# EAGLE design SUSTAINA-Constant-Voltage-Board (EAGLE 9.6.2)
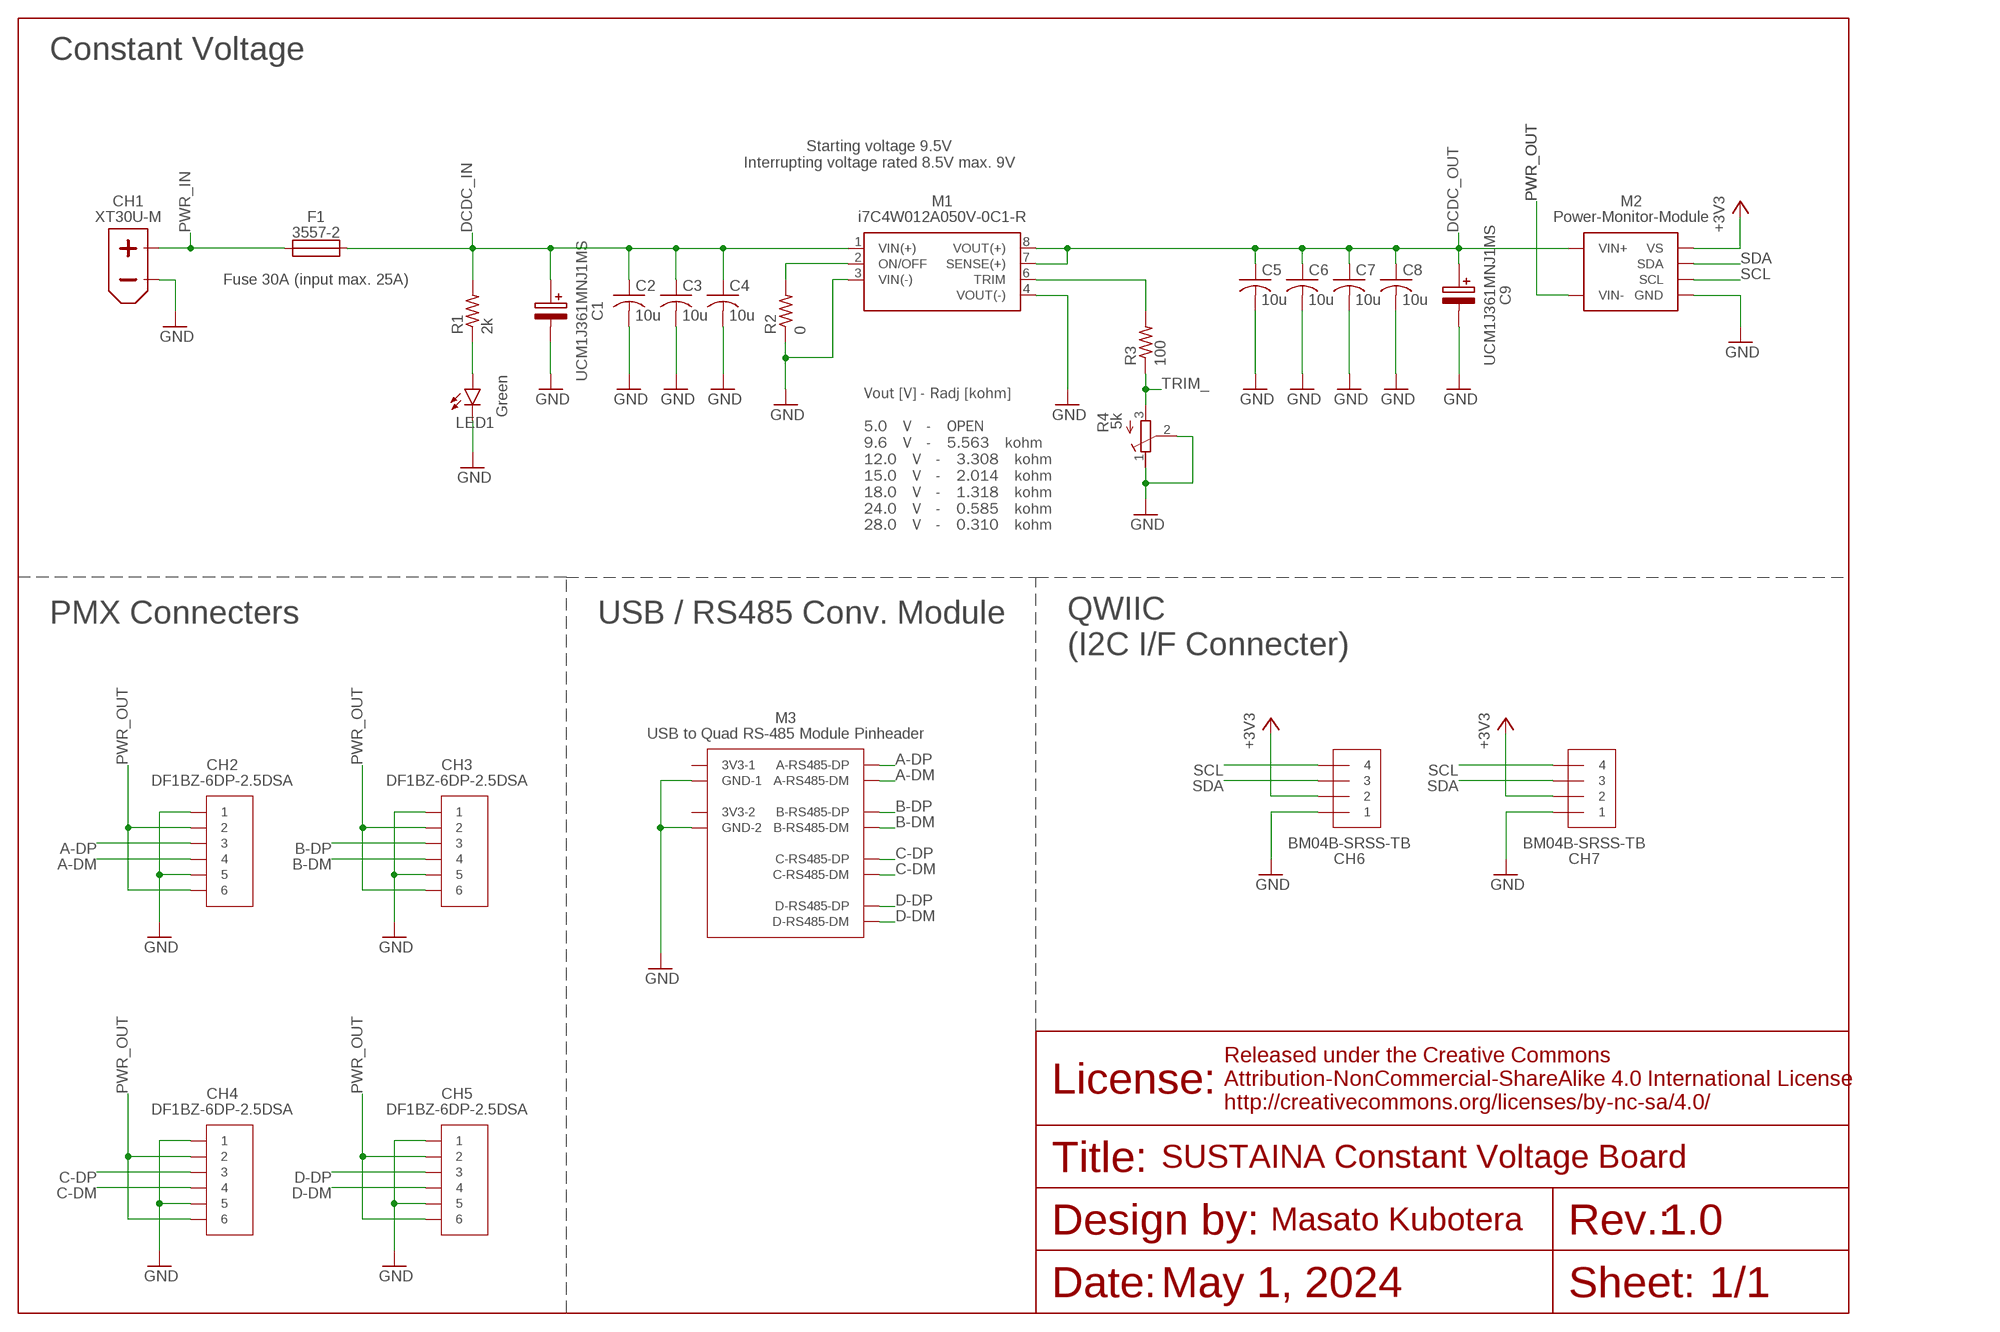
[diagram p0: schematic, sheet 1]

## Parts
C1  UCM1J361MNJ1MS  [UCM1J361MNJ1MS]
C2  10u  C-USC1210  [C1210]
C3  10u  C-USC1210  [C1210]
C4  10u  C-USC1210  [C1210]
C5  10u  C-USC1210  [C1210]
C6  10u  C-USC1210  [C1210]
C7  10u  C-USC1210  [C1210]
C8  10u  C-USC1210  [C1210]
C9  UCM1J361MNJ1MS  [UCM1J361MNJ1MS]
CH1  XT30U-M  [XT30U-M]
CH2  DF1BZ-6DP-25DSA  [DF1BZ-6DP-25DSA]
CH3  DF1BZ-6DP-25DSA  [DF1BZ-6DP-25DSA]
CH4  DF1BZ-6DP-25DSA  [DF1BZ-6DP-25DSA]
CH5  DF1BZ-6DP-25DSA  [DF1BZ-6DP-25DSA]
CH6  BM04B-SRSS-TB  [BM04B-SRSS-TB]
CH7  BM04B-SRSS-TB  [BM04B-SRSS-TB]
F1  3557-2  [3557-2]
LED1  Green  LEDSML0603  [SML0603]
M1  I7C4W012A050V-0C1-R  [I7C4W012A050V-001-R]
M2  POWER-MONITOR-MODULE  [POWER-MONITOR-MODULE]
M3  USB-TO-QUAD-RS-485-CONV-MODULETPLACE  [USB-TO-QUAD-RS-485-CONV-MODULE-TPLACE]
R1  2k  R-US_R0603  [R0603]
R2  0  R-US_R0603  [R0603]
R3  100  R-US_R0603  [R0603]
R4  5k  R-TRIMM3006P  [RTRIM3006P]

## Nets
+3V3 [low-power]: CH6.2 CH7.2 M2.VS
A-DM [signal]: CH2.4 M3.A-RS-485-DM1(A-RS485-DM) M3.A-RS-485-DM2(A-RS485-DM)
A-DP [signal]: CH2.3 M3.A-RS-485-DP1(A-RS485-DP) M3.A-RS-485-DP2(A-RS485-DP)
B-DM [signal]: CH3.4 M3.B-RS-485-DM1(B-RS485-DM) M3.B-RS-485-DM2(B-RS485-DM)
B-DP [signal]: CH3.3 M3.B-RS-485-DP1(B-RS485-DP) M3.B-RS-485-DP2(B-RS485-DP)
C-DM [signal]: CH4.4 M3.C-RS-485-DM1(C-RS485-DM) M3.C-RS-485-DM2(C-RS485-DM)
C-DP [signal]: CH4.3 M3.C-RS-485-DP1(C-RS485-DP) M3.C-RS-485-DP2(C-RS485-DP)
D-DM [signal]: CH5.4 M3.D-RS-485-DM1(D-RS485-DM) M3.D-RS-485-DM2(D-RS485-DM)
D-DP [signal]: CH5.3 M3.D-RS-485-DP1(D-RS485-DP) M3.D-RS-485-DP2(D-RS485-DP)
DCDC_IN [power]: C1.+ C2.1 C3.1 C4.1 F1.3 F1.4 M1.1(VIN(+)) R1.2
DCDC_OUT [power]: C5.1 C6.1 C7.1 C8.1 C9.+ M1.7(SENSE(+)) M1.8(VOUT(+)) M2.VIN+1(VIN+) M2.VIN+2(VIN+) M2.VIN+3(VIN+) M2.VIN+4(VIN+) M2.VIN+5(VIN+) M2.VIN+6(VIN+) M2.VIN+7(VIN+) M2.VIN+8(VIN+) M2.VIN+9(VIN+) M2.VIN+10(VIN+)
GND [power]: C1.- C2.2 C3.2 C4.2 C5.2 C6.2 C7.2 C8.2 C9.- CH1.- CH2.1 CH2.5 CH3.1 CH3.5 CH4.1 CH4.5 CH5.1 CH5.5 CH6.1 CH7.1 LED1.C M1.3(VIN(-)) M1.4(VOUT(-)) M2.GND M3.GND-1 M3.GND-2 M3.GND-3(GND-1) M3.GND-4(GND-2) R2.1 R4.1(E) R4.2(S)
LED_DCDC-IN [low-power]: LED1.A R1.1
ONOFF: M1.2(ON/OFF) R2.2
PWR_IN [power]: CH1.+ F1.1 F1.2
PWR_OUT [power]: CH2.2 CH2.6 CH3.2 CH3.6 CH4.2 CH4.6 CH5.2 CH5.6 M2.VIN-1(VIN-) M2.VIN-2(VIN-) M2.VIN-3(VIN-) M2.VIN-4(VIN-) M2.VIN-5(VIN-) M2.VIN-6(VIN-) M2.VIN-7(VIN-) M2.VIN-8(VIN-) M2.VIN-9(VIN-) M2.VIN-10(VIN-)
SCL [signal]: CH6.4 CH7.4 M2.SCL
SDA [signal]: CH6.3 CH7.3 M2.SDA
TRIM: M1.6(TRIM) R3.2
TRIM_: R3.1 R4.3(A)
Unconnected: M3.3V3-1 M3.3V3-2 M3.3V3-3(3V3-1) M3.3V3-4(3V3-2)

## Notes on the sheet
- Constant Voltage
- Starting voltage 9.5V
  Interrupting voltage rated 8.5V max. 9V
- Fuse 30A (input max. 25A)
- Vout [V] - Radj [kohm]
  
  5.0　V　-　OPEN
  9.6　V　-　5.563　kohm
  12.0　V　-　3.308　kohm
  15.0　V　-　2.014　kohm
  18.0　V　-　1.318　kohm
  24.0　V　-　0.585　kohm
  28.0　V　-　0.310　kohm
- PMX Connecters | USB / RS485 Conv. Module
- QWIIC
  (I2C I/F Connecter)
- SUSTAINA Constant Voltage Board
- 1.0
- May 1, 2024 | 1/1

## Library data of the parts
C1 C9 = UCM1J361MNJ1MS:UCM1J361MNJ1MS
C2-C8 = rcl:C-US: CAPACITOR, American symbol; SPICEPREFIX: C
CH1 = XT30:XT30U-M
CH2-CH5 = DF1BZ-6DP-2.5DSA:DF1BZ-6DP-25DSA
CH6 CH7 = SH-Connecters:BM04B-SRSS-TB
F1 = 3557-2:3557-2
LED1 = led:LED: LED OSRAM: - CHIPLED LG R971, LG N971, LY N971, LG Q971, LY Q971, LO R971, LY R971 LH N974, LH R974 LS Q976, LO Q976, LY Q976 LO Q996 - Hyper CHIPLED LW Q18S LB Q993, LB Q99A, LB R99A - SideLED LS A670, LO A670, LY A670, LG A670, LP A670 LB A673, LV A673, LT A673, LW A673 LH A674 LY A675 LS A676, LA A676, LO A676, LY A676, LW A676 LS A679, LY A679, LG A679 - Hyper Micro SIDELED® LS Y876, LA Y876, LO Y876, LY Y876 LT Y87S - SmartLED LW L88C, LW L88S LB L89C, LB L89S, LG L890 LS L89K, LO L89K, LY L89K LS L896, LA L896, LO L896, LY L896 - TOPLED LS T670, LO T670, LY T670, LG T670, LP T670 LSG T670, LSP T670, LSY T670, LOP T670, LYG T670 LG T671, LOG T671, LSG T671 LB T673, LV T673, LT T673, LW T673 LH T674 LS T676, LA T676, LO T676, LY T676, LB T676, LH T676, LSB T676, LW T676 LB T67C, LV T67C, LT T67C, LS T67K, LO T67K, LY T67K, LW E67C LS E67B, LA E67B, LO E67B, LY E67B, LB E67C, LV E67C, LT E67C LW T67C LS T679, LY T679, LG T679 LS T770, LO T770, LY T770, LG T770, LP T770 LB T773, LV T773, LT T773, LW T773 LH T774 LS E675, LA E675, LY E675, LS T675 LS T776, LA T776, LO T776, LY T776, LB T776 LHGB T686 LT T68C, LB T68C - Hyper Mini TOPLED® LB M676 - Mini TOPLED Santana® LG M470 LS M47K, LO M47K, LY M47K Source: http://www.osram.convergy.de LUXEON: - LUMILED® LXK2-PW12-R00, LXK2-PW12-S00, LXK2-PW14-U00, LXK2-PW14-V00 LXK2-PM12-R00, LXK2-PM12-S00, LXK2-PM14-U00 LXK2-PE12-Q00, LXK2-PE12-R00, LXK2-PE12-S00, LXK2-PE14-T00, LXK2-PE14-U00 LXK2-PB12-K00, LXK2-PB12-L00, LXK2-PB12-M00, LXK2-PB14-N00, LXK2-PB14-P00, LXK2-PB14-Q00 LXK2-PR12-L00, LXK2-PR12-M00, LXK2-PR14-Q00, LXK2-PR14-R00 LXK2-PD12-Q00, LXK2-PD12-R00, LXK2-PD12-S00 LXK2-PH12-R00, LXK2-PH12-S00 LXK2-PL12-P00, LXK2-PL12-Q00, LXK2-PL12-R00 Source: www.luxeon.com KINGBRIGHT: KA-3528ASYC Source: www.kingbright.com
M1 = i7C4W012A050V-0C1-R:I7C4W012A050V-0C1-R
M2 = Power-Monitor-Module:POWER-MONITOR-MODULE
M3 = USB-to-Quad-RS-485-Conv-Module:USB-TO-QUAD-RS-485-CONV-MODULE
R1-R3 = rcl:R-US_: RESISTOR, American symbol; SPICEPREFIX: R
R4 = rcl:R-TRIMM: Trimm resistor; SPICEMODEL: X; SPICEPREFIXL: POT

## Net classes
0 default: width 0.254 mm, clearance 0.127 mm
1 signal: width 0.203 mm, clearance 0.127 mm
2 power: width 0.254 mm, clearance 0.127 mm
3 low-power: width 0.254 mm

## Board
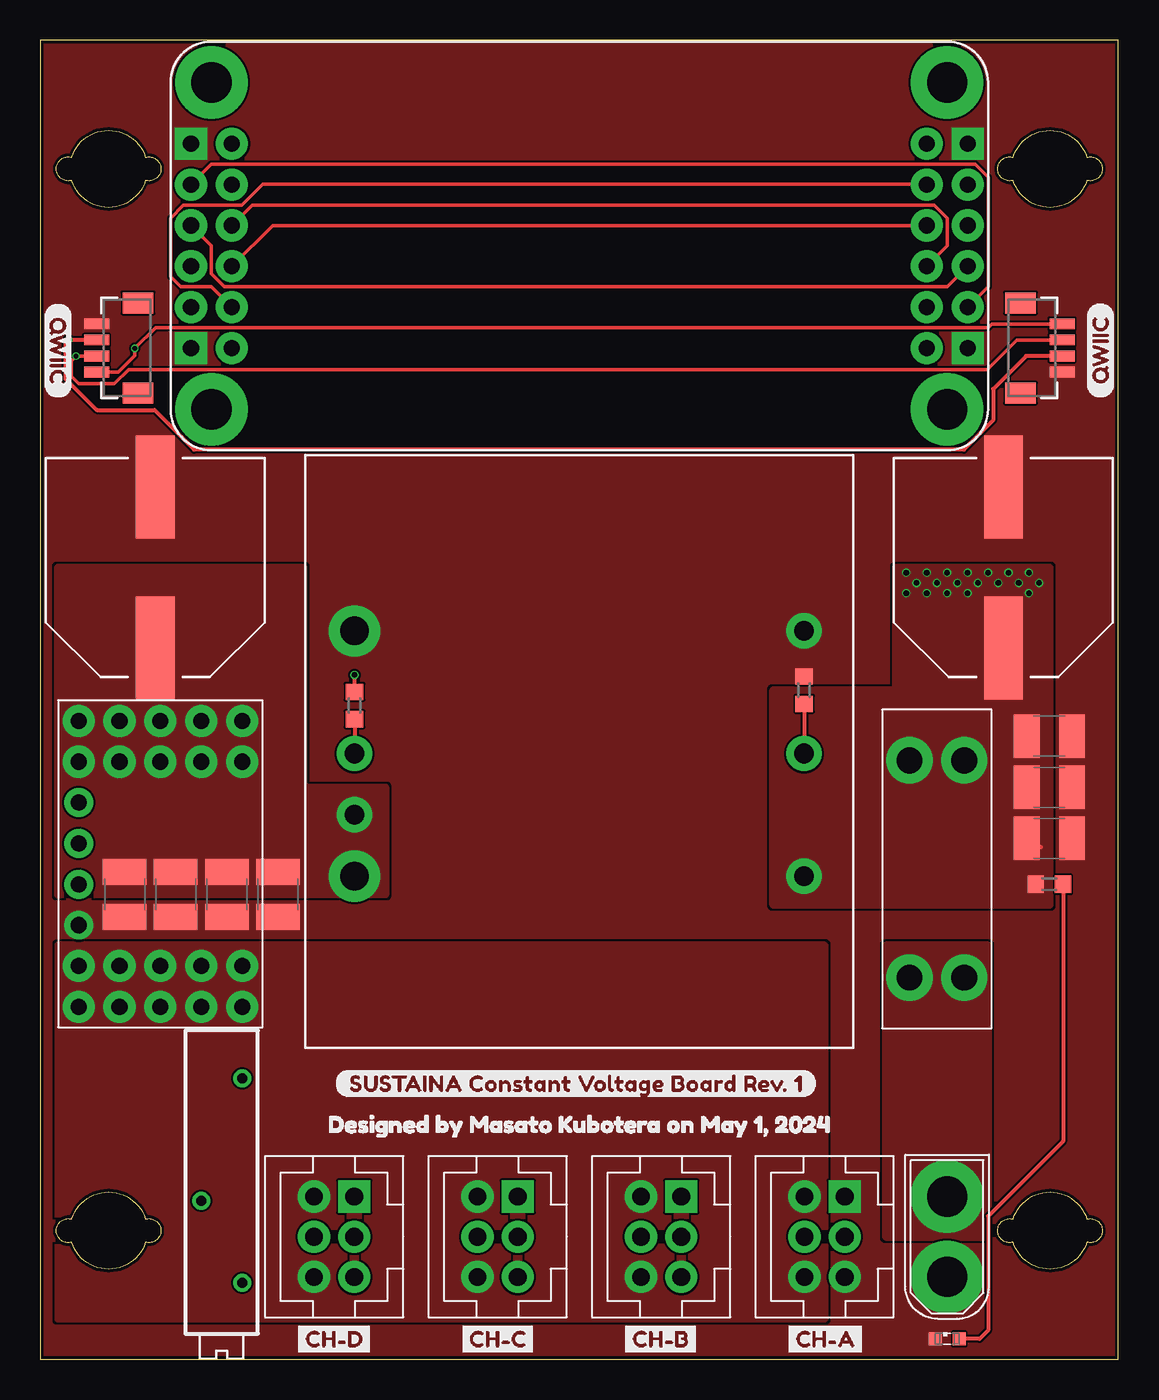
[diagram p1: board, top side]
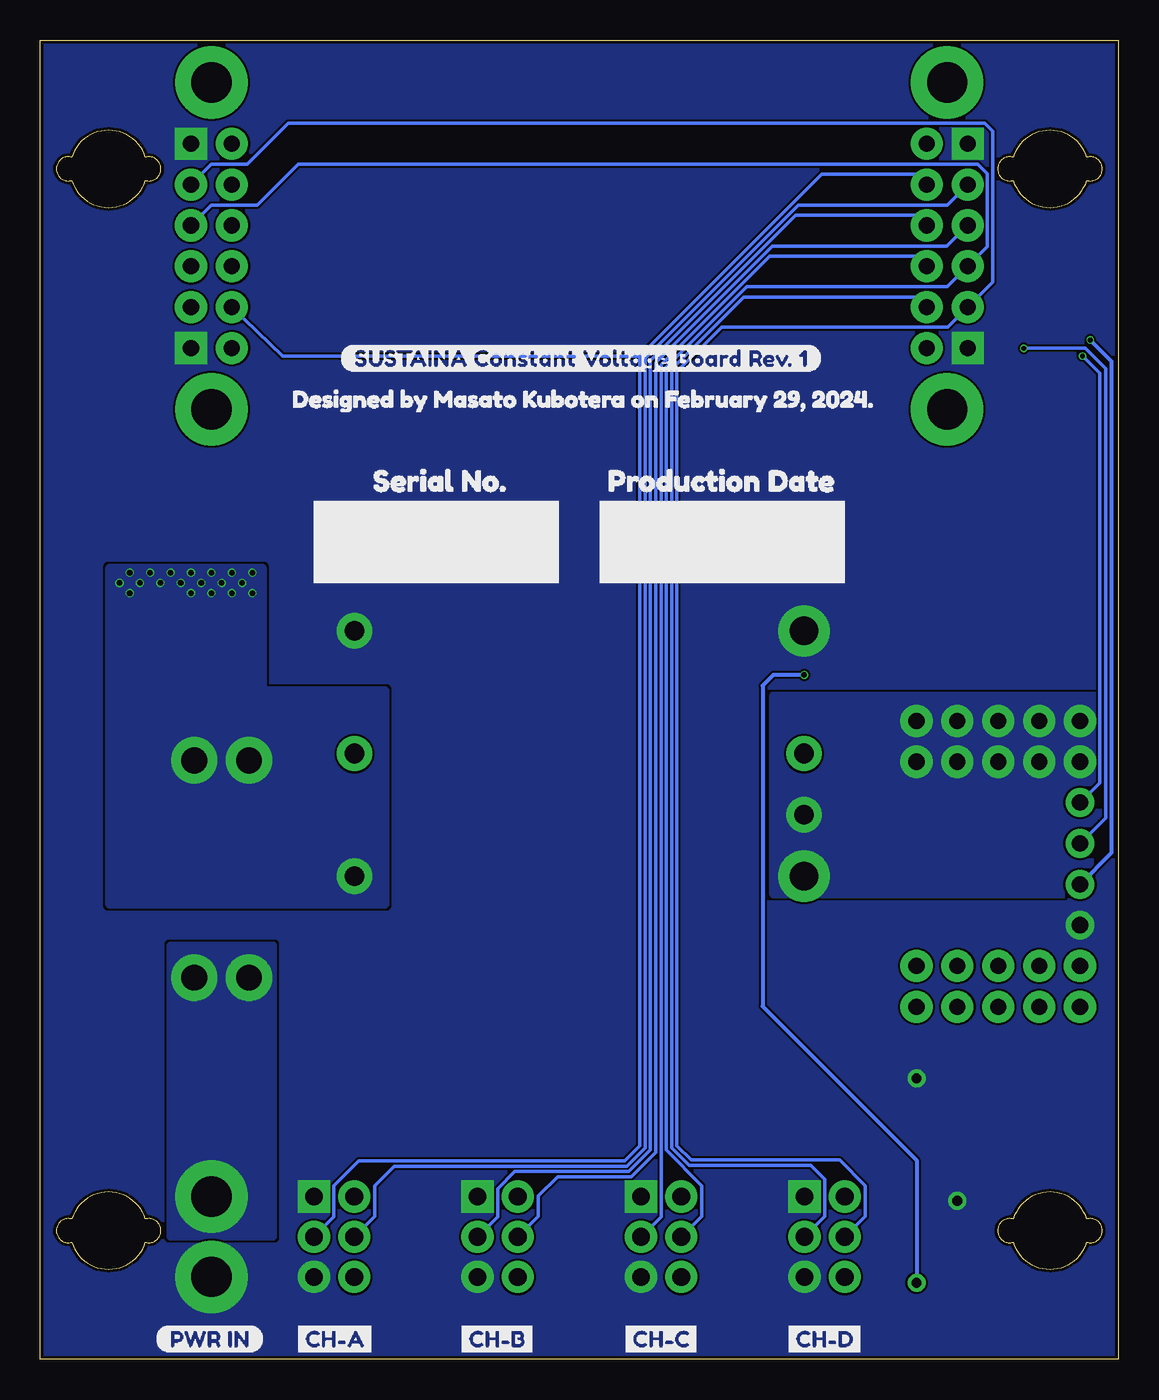
[diagram p2: board, bottom side, seen from below]

Size 67 x 82 mm. Coordinates in mm from the lower left corner, seen from the top.
Outline: 67,82 0,82 0,0 67,0 67,82
Outline: 1.96,7.28 arc-213 1.96,8.72 arc-145 6.54,8.72 arc-213 6.54,7.28 arc-145 1.96,7.28
Outline: 1.96,73.28 arc-213 1.96,74.72 arc-145 6.54,74.72 arc-213 6.54,73.28 arc-145 1.96,73.28
Outline: 65.04,74.72 arc-213 65.04,73.28 arc-145 60.46,73.28 arc-213 60.46,74.72 arc-145 65.04,74.72
Outline: 65.04,8.72 arc-213 65.04,7.28 arc-145 60.46,7.28 arc-213 60.46,8.72 arc-145 65.04,8.72
Copper layers (1*16): Top 0.035mm / dielectric 1.6mm / Bottom 0.035mm
Design rules "jlcpcb-2layers": minimum track width 5mil, minimum drill 0.3mm, track to track 5mil, track to pad 5mil, pad to pad 5mil, via to via 5mil, smd to smd 5mil, copper to edge 0.2mm, drill to drill 6mil, minimum pad ring 10mil, minimum via ring 3mil, stop-mask expansion 4mil, vias tented up to drill 0mil, thermal gap 10mil

### Footprints (pad centres in the part's own frame; a part is rotated, then mirrored left to right if it is on the bottom)
UCM1J361MNJ1MS = smd 6.4 x 2.4: + -5,0; - 5,0
C1210 = smd 1.6 x 2.7: 1 -1.4,0; 2 1.4,0
XT30U-M = drill 2.5 pad 4.5: + 2.5,0; - -2.5,0
DF1BZ-6DP-25DSA = drill 1.1 pad 2 square: 1 -2.5,1.25 | drill 1.1 pad 2: 2 -2.5,-1.25; 3 0,1.25; 4 0,-1.25; 5 2.5,1.25; 6 2.5,-1.25
BM04B-SRSS-TB = smd 0.66 x 1.549: 1 1.5,3.33; 2 0.5,3.33; 3 -0.5,3.33; 4 -1.5,3.33 | smd 1.295 x 1.905: 5 2.8,0.75; 6 -2.8,0.75
3557-2 = drill 1.6: 1 -6.75,1.7; 2 -6.75,-1.7; 3 6.75,1.7; 4 6.75,-1.7
SML0603 = smd 0.8 x 0.8: A 0.75,0; C -0.75,0
I7C4W012A050V-001-R = drill 1.22 pad 1.83: 1 -13.97,7.745; 2 -13.97,0.125; 3 -13.97,-7.495; 6 13.97,0.125; 7 13.97,3.935 | drill 1.77 pad 2.655: 4 13.97,-7.495; 8 13.97,7.745
POWER-MONITOR-MODULE = drill 1: GND 13.97,-11.43; SCL 8.89,-11.43; SDA 6.35,-11.43; VS 11.43,-11.43 | drill 1 pad 2: VIN+1 1.27,-1.27; VIN+2 3.81,-1.27; VIN+3 1.27,-3.81; VIN+4 3.81,-3.81; VIN+5 1.27,-6.35; VIN+6 3.81,-6.35; VIN+7 1.27,-8.89; VIN+8 3.81,-8.89; VIN+9 1.27,-11.43; VIN+10 3.81,-11.43; VIN-1 16.51,-1.27; VIN-2 19.05,-1.27; VIN-3 16.51,-3.81; VIN-4 19.05,-3.81; VIN-5 16.51,-6.35; VIN-6 19.05,-6.35; VIN-7 16.51,-8.89; VIN-8 19.05,-8.89; VIN-9 16.51,-11.43; VIN-10 19.05,-11.43
USB-TO-QUAD-RS-485-CONV-MODULE-TPLACE = drill 1 pad 2: 3V3-1 3.81,6.35; 3V3-2 3.81,-6.35; 3V3-3 46.99,-6.35; 3V3-4 46.99,6.35; A-RS-485-DM1 1.27,3.81; A-RS-485-DM2 49.53,-3.81; A-RS-485-DP1 3.81,3.81; A-RS-485-DP2 46.99,-3.81; B-RS-485-DM1 1.27,1.27; B-RS-485-DM2 49.53,-1.27; B-RS-485-DP1 3.81,1.27; B-RS-485-DP2 46.99,-1.27; C-RS-485-DM1 1.27,-1.27; C-RS-485-DM2 49.53,1.27; C-RS-485-DP1 3.81,-1.27; C-RS-485-DP2 46.99,1.27; D-RS-485-DM1 1.27,-3.81; D-RS-485-DM2 49.53,3.81; D-RS-485-DP1 3.81,-3.81; D-RS-485-DP2 46.99,3.81 | drill 1 pad 2 square: GND-1 1.27,6.35; GND-2 1.27,-6.35; GND-3 49.53,-6.35; GND-4 49.53,6.35 | drill 2.5 pad 4.5: H1 2.54,10.16; H2 2.54,-10.16; H3 48.26,10.16; H4 48.26,-10.16
R0603 = smd 1 x 1.1: 1 -0.85,0; 2 0.85,0
RTRIM3006P = drill 0.61: 1 -7.62,1.27; 2 0,-1.27; 3 5.08,1.27

### Placement (x,y rotation side)
C1  59.85,49.21 90 top
C2  62.71,32.38 0 top
C3  62.71,35.56 0 top
C4  62.71,38.73 0 top
C5  5.24,28.89 270 top
C6  8.42,28.89 270 top
C7  11.59,28.89 270 top
C8  14.77,28.89 270 top
C9  7.15,49.21 90 top
CH1  56.36,7.62 90 top
CH2  48.74,7.62 270 top
CH3  38.58,7.62 270 top
CH4  28.42,7.62 270 top
CH5  18.26,7.62 270 top
CH6  60.17,62.87 270 top
CH7  6.83,62.87 90 top
F1  55.73,30.48 90 top
LED1  56.36,1.27 0 top
M1  33.5,37.78 180 top
M2  13.82,40.96 270 top
M3  8.1,69.22 0 top
R1  62.71,29.53 180 top
R2  47.47,41.59 270 top
R3  19.53,40.64 270 top
R4  11.27,9.84 270 top
U$1  CONSTANT_VOLTAGE_REV#_10  [SUSTAINA_CONSTANT_VOLTAGE_BOARD_REV#_1]  18.26,17.14 0 top
U$2  DESIGNED_BY_MASATO_KUBOTERA_ON_FEBRUARY_190DESIGNED_BY_MASATO_KUBOTERA_ON_FEBRUARY_190  [DESIGNED_BY_MASATO_KUBOTERA_ON_FEBRUARY_290]  52.23,59.69 0 bottom
U$3  PRODUCTION_DATE0  [PRODUCTION_DATE0]  32.87,54.61 0 bottom
U$4  SERIAL_NO#0  [SERIAL_NO#0]  47.47,54.61 0 bottom
U$6  [QWIIC0]  65.88,59.69 90 top
U$7  [QWIIC0]  1.12,65.72 270 top
U$8  [CH#A1]  46.04,1.27 0 top
U$9  [CH#B1]  35.88,1.27 0 top
U$10  [CH#C1]  25.72,1.27 0 top
U$11  [CH#D1]  15.56,1.27 0 top
U$12  [CH#A1]  51.44,1.27 0 bottom
U$13  [CH#B1]  41.28,1.27 0 bottom
U$14  [CH#C1]  31.12,1.27 0 bottom
U$15  [CH#D1]  20.96,1.27 0 bottom
U$16  [PWR_IN0]  59.85,1.27 0 bottom
U$17  [DESIGNED_BY_MASATO_KUBOTERA_ON_MAY_1]  16.99,14.61 0 top
U$18  CONSTANT_VOLTAGE_REV#_10  [SUSTAINA_CONSTANT_VOLTAGE_BOARD_REV#_1]  48.42,62.23 0 bottom

### Tracks (layer width: path | path; a pad name or v marks a point on that pad's centre or on a via)
+3V3  (via drill 0.3)
  Top 0.254: CH7.2 v1.75,63.37 1.57,63.18 1.57,60.96 3.52,59.01 7.11,59.01 9.57,56.55 57.4,56.55 59.22,58.37 59.22,60.32 61.26,62.37 CH6.2
  Bottom 0.254: M2.VS 0.42,31.5 0.42,62.03 v1.75,63.37
A-DM
  Top 0.203: M3.A-RS-485-DM1 10.64,74.3 58.1,74.3 58.9,73.49 58.9,66.67 M3.A-RS-485-DM2
  Bottom 0.203: M3.A-RS-485-DM1 10.64,71.75 19.89,71.75 29.41,62.23 29.41,13.15 30.55,12.01 44.99,12.01 46.2,10.79 46.2,8.89 46.22,8.89 CH2.4
A-DP
  Bottom 0.203: 29.74,62.37 51.94,62.37 M3.A-RS-485-DP2 | 29.74,62.37 18.45,73.66 11.91,73.66 M3.A-RS-485-DP1 | CH2.3 48.76,8.85 48.76,10.77 47.2,12.34 30.69,12.34 29.74,13.28 29.74,62.37
B-DM
  Top 0.203: M3.B-RS-485-DM2 56.36,66.67 11.44,66.67 10.64,67.48 10.64,69.22 M3.B-RS-485-DM1
  Bottom 0.203: M3.B-RS-485-DM1 10.65,69.2 21.5,69.2 28.75,61.96 28.75,12.87 30.27,11.35 34.85,11.35 36.05,10.15 36.05,8.9 CH3.4
B-DP
  Top 0.203: M3.B-RS-485-DP2 56.36,69.22 56.36,70.95 55.56,71.75 13.18,71.75 M3.B-RS-485-DP1
  Bottom 0.203: M3.B-RS-485-DP1 11.91,71.12 20.05,71.12 29.08,62.09 29.08,13.01 30.41,11.68 37.51,11.68 38.58,10.61 38.58,8.87 CH3.3
C-DM
  Bottom 0.203: M3.C-RS-485-DM2 56.36,71.75 53.5,71.75 50.96,74.3 8.73,74.3 8.14,73.7 8.14,69.17 M3.C-RS-485-DM1 10.64,66.67 23.1,66.67 28.09,61.68 28.09,13.01 25.88,10.79 25.88,8.89 27.15,7.62 CH4.4
C-DP
  Top 0.203: M3.C-RS-485-DP1 14.45,70.48 M3.C-RS-485-DP2
  Bottom 0.203: M3.C-RS-485-DP1 11.91,68.56 11.9,68.57 21.67,68.57 28.42,61.82 28.42,8.87 CH4.3
D-DM
  Bottom 0.203: M3.D-RS-485-DM2 56.36,74.3 54.14,74.3 51.6,76.83 8.32,76.83 7.81,76.33 7.81,66.96 M3.D-RS-485-DM1 10.6,64.18 24.66,64.18 27.43,61.41 27.43,13.28 26.55,12.39 17.32,12.39 15.72,10.79 15.72,8.89 16.99,7.62 CH5.4
D-DP
  Top 0.203: M3.D-RS-485-DP2 55.08,73.04 13.82,73.04 12.53,71.75 8.9,71.75 8.1,70.95 8.1,67.31 8.73,66.67 10.64,66.67 M3.D-RS-485-DP1
  Bottom 0.203: M3.D-RS-485-DP1 11.91,66.04 23.27,66.04 27.76,61.55 27.76,13.14 26.68,12.06 19.13,12.06 18.26,11.19 18.26,8.89 CH5.3
DCDC_IN  (via drill 0.35)
  Top 0.254: C2.1 62.18,31.84
  other vias: 55.09,48.9 61.44,48.9 60.17,48.9 58.9,48.9 57.63,48.9 56.36,48.9 53.82,48.9 55.73,48.26 57.63,47.62 58.27,48.26 56.36,47.62 57,48.26 55.09,47.62 53.82,47.62 54.45,48.26 61.44,47.62 60.8,48.26 62.08,48.26 59.53,48.26
  pour Top (rank 2, no thermals): 62.71,28.26 45.56,28.26 45.56,41.59 53.19,41.59 53.19,49.21 62.71,49.21
  pour Bottom (no thermals): 45.56,41.59 45.56,28.26 62.71,28.26 62.71,49.21 53.19,49.21 53.19,41.59
DCDC_OUT
  pour Top (rank 2, no thermals): 21.44,28.89 1.12,28.89 1.12,49.21 16.36,49.21 16.36,35.56 21.44,35.56
  pour Bottom (no thermals): 1.12,41.27 1.12,28.89 21.44,28.89 21.44,41.27
GND
  pour Top (rank 6, no thermals): -0.79,82.55 -0.79,-1.27 67.79,-1.27 67.79,82.55
  pour Bottom (rank 6, no thermals): -2.06,83.82 -2.06,-2.54 69.06,-2.54 69.06,83.82
LED_DCDC-IN
  Top 0.254: LED1.A 58.38,1.27 58.9,1.79 58.9,8.89 63.56,13.55 R1.1
ONOFF
  Top 0.254: R2.2 M1.2
PWR_IN
  pour Top (rank 2, no thermals): 52.55,25.72 52.55,7.62 58.9,7.62 58.9,25.72
  pour Bottom (rank 2, no thermals): 52.55,25.72 52.55,7.62 58.9,7.62 58.9,25.72
PWR_OUT
  pour Top (no thermals): 1.12,25.72 1.12,2.54 48.74,2.54 48.74,25.72
SCL  (via drill 0.3)
  Top 0.203: CH7.4 4.86,61.37 5.88,62.38 v5.88,62.84 7.17,64.14 58.9,64.14 59.13,64.36 CH6.4
  Bottom 0.203: M2.SCL 0.8,33.66 0.8,61.59 2.05,62.84 v5.88,62.84
SDA  (via drill 0.3)
  Top 0.203: CH7.3 v2.23,62.37 1.92,62.06 1.92,61.11 2.39,60.64 4.61,60.64 5.5,61.53 58.84,61.53 60.67,63.37 CH6.3
  Bottom 0.203: M2.SDA 1.15,35.84 1.15,61.29 v2.23,62.37
TRIM
  Top 0.254: 19.53,37.36 M1.6 R3.2
TRIM_  (via drill 0.35)
  Top 0.254: R3.1 v19.53,42.55
  Bottom 0.254: v19.53,42.55 21.44,42.55 22.11,41.87 22.11,21.94 12.55,12.38 R4.3